# Altium project WaterPurifier.PrjPcb
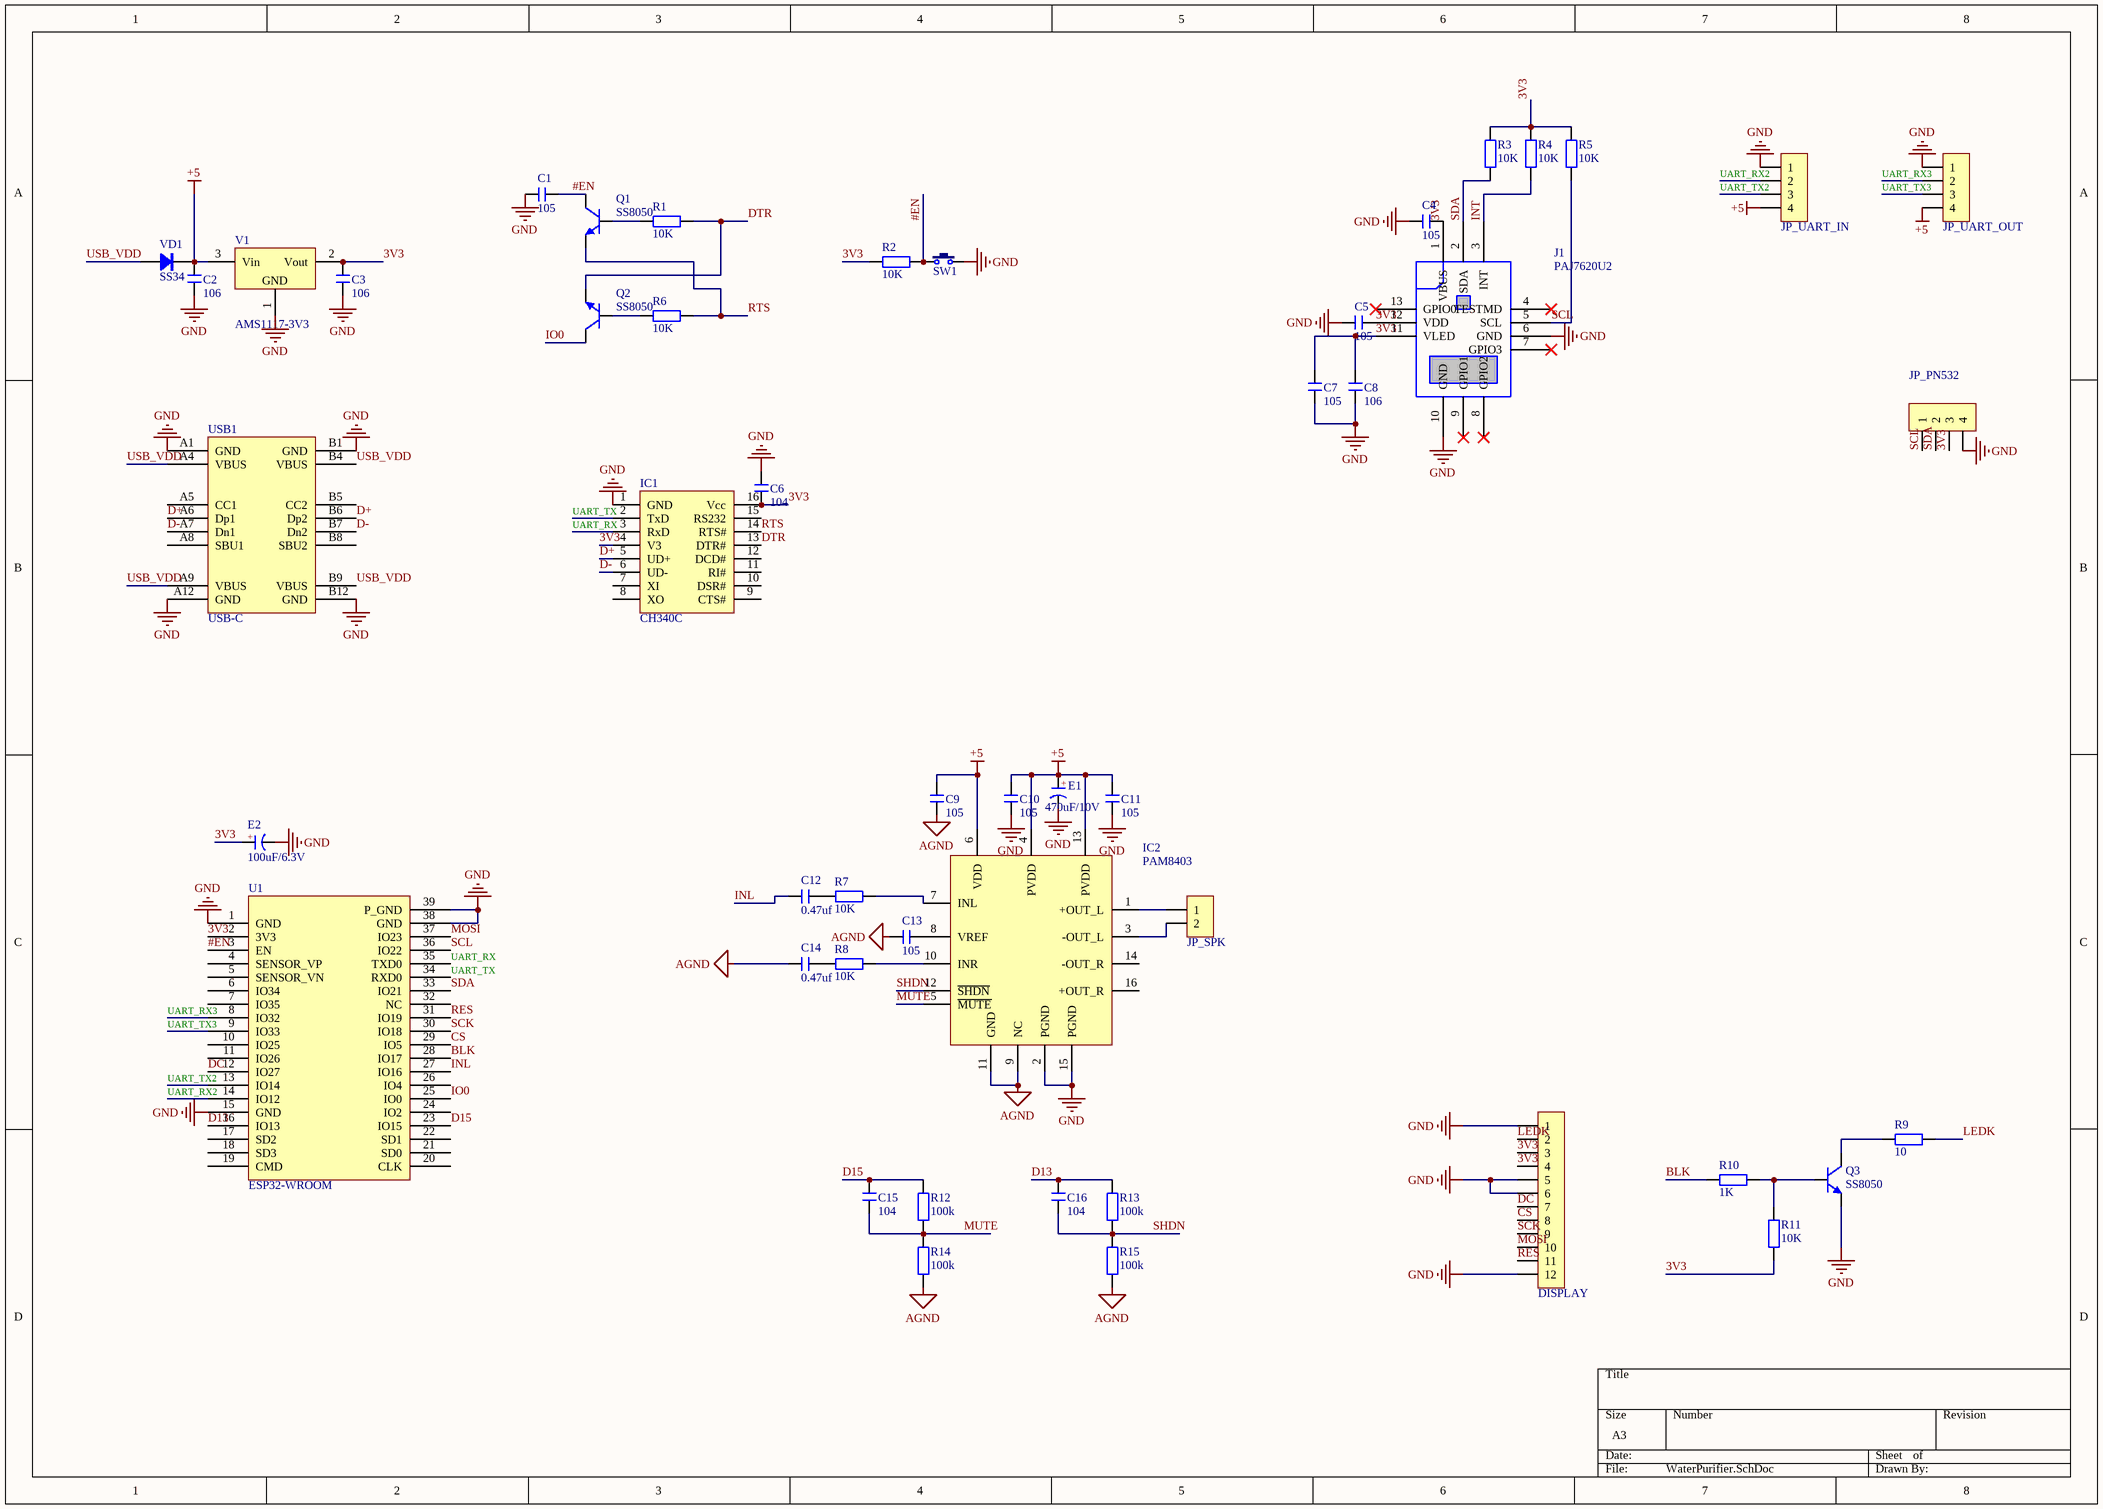
[diagram p0: WaterPurifier.SchDoc]
1 sheet, 49 parts. Net scope: global (net labels, ports and power ports of the same name join across sheets).
Board file: WaterPurifier.PcbDoc

## Sheet WaterPurifier.SchDoc
size A3

### Parts
C1  105  [C 0603_L]
C2  106  [C 0603_L]
C3  106  [C 0603_L]
C4  105  [C 0603_L]
C5  105  [C 0603_L]
C6  104  [C 0603_L]
C7  105  [C 0603_L]
C8  106  [C 0603_L]
C9  105  [C 0603_L]
C10  105  [C 0603_L]
C11  105  [C 0603_L]
C12  0.47uf  [C 0603_L]
C13  105  [C 0603_L]
C14  0.47uf  [C 0603_L]
C15  104  [C 0603_L]
C16  104  [C 0603_L]
DISPLAY  FPC1.0-12P  [FPC0.7 2H-WS-12P]  (value not drawn)
E1  470uF/10V  [CM D(6.3*7.7)]
E2  100uF/6.3V  [CD A(3216)]
IC1  CH340C  [SOP16_N]
IC2  PAM8403  [SOP16_N]
J1  PAJ7620U2  [PAJ7620U2]
JP_PN532  HDR-1X4  [XH2.54-LI-4P]  (value not drawn)
JP_SPK  HDR-1X2  [XH2.54-LI-2P]  (value not drawn)
JP_UART_IN  HDR-1X4  [XH2.54-LI-4P]  (value not drawn)
JP_UART_OUT  HDR-1X4  [XH2.54-LI-4P]  (value not drawn)
Q1  SS8050  [SOT23-3N]
Q2  SS8050  [SOT23-3N]
Q3  SS8050  [SOT23-3N]
R1  10K  [R 0603_L]
R2  10K  [R 0603_L]
R3  10K  [R 0603_L]
R4  10K  [R 0603_L]
R5  10K  [R 0603_L]
R6  10K  [R 0603_L]
R7  10K  [R 0603_L]
R8  10K  [R 0603_L]
R9  10  [R 0603_L]
R10  1K  [R 0603_L]
R11  10K  [R 0603_L]
R12  100k  [R 0603_L]
R13  100k  [R 0603_L]
R14  100k  [R 0603_L]
R15  100k  [R 0603_L]
SW1  3x6x5  [TS3x4x2]  (value not drawn)
U1  ESP32-WROOM  [ESP32-WROOM]
USB1  USB-C  [USB Type-C-16Pin_A]
V1  AMS1117-3V3  [SOT223_N]
VD1  SS34  [SMA]

### Nets
+5: C2.2 C9.2 C10.2 C11.2 E1.1(A) IC2.4(PVDD) IC2.6(VDD) IC2.13(PVDD) JP_UART_IN.4 JP_UART_OUT.4 V1.3(Vin) VD1.2(K)
AGND: C9.1 C13.2 C14.2 IC2.9(NC) IC2.11(GND) R14.1 R15.1
GND: C1.1 C2.1 C3.1 C4.1 C5.1 C6.1 C7.1 C8.1 C10.1 C11.1 DISPLAY.1 DISPLAY.5 DISPLAY.6 DISPLAY.12 E1.2(K) E2.2(K) IC1.1(GND) IC2.2(PGND) IC2.15(PGND) J1.6(GND) J1.10(GND) JP_PN532.4 JP_UART_IN.1 JP_UART_OUT.1 Q3.2(E) SW1.2 U1.1(GND) U1.15(GND) U1.38(GND) U1.39(P_GND) USB1.A1(GND) USB1.A12(GND) USB1.B1(GND) USB1.B12(GND) V1.1(GND)
3V3: C3.2 C4.2 C5.2 C6.2 C7.2 C8.2 DISPLAY.3 DISPLAY.4 E2.1(A) IC1.4(V3) IC1.16(Vcc) J1.1(VBUS) J1.11(VLED) J1.12(VDD) JP_PN532.3 R2.2 R3.1 R4.1 R5.1 R11.1 U1.2(3V3) V1.2(Vout)
#EN: C1.2 Q1.3(C) R2.1 SW1.1 U1.3(EN)
BLK: R10.1 U1.28(IO17)
CS: DISPLAY.8 U1.29(IO5)
D13: C16.2 R13.2 U1.16(IO13)
D15: C15.2 R12.2 U1.23(IO15)
D+: IC1.5(UD+) USB1.A6(Dp1) USB1.B6(Dp2)
D-: IC1.6(UD-) USB1.A7(Dn1) USB1.B7(Dn2)
DC: DISPLAY.7 U1.12(IO27)
DTR: IC1.13(DTR#) Q2.2(E) R1.1
INL: C12.2 U1.27(IO16)
INT: J1.3(INT) R4.2
IO0: Q2.3(C) U1.25(IO0)
LEDK: DISPLAY.2 R9.1
MOSI: DISPLAY.10 U1.37(IO23)
MUTE: C15.1 IC2.5(~{MUTE}) R12.1 R14.2
RES: DISPLAY.11 U1.31(IO19)
RTS: IC1.14(RTS#) Q1.2(E) R6.1
SCK: DISPLAY.9 U1.30(IO18)
SCL: J1.5(SCL) JP_PN532.1 R5.2 U1.36(IO22)
SDA: J1.2(SDA) JP_PN532.2 R3.2 U1.33(IO21)
SHDN: C16.1 IC2.12(~{SHDN}) R13.1 R15.2
UART_RX: IC1.3(RxD) U1.35(TXD0)
UART_RX2: JP_UART_IN.2 U1.14(IO12)
UART_RX3: JP_UART_OUT.2 U1.8(IO32)
UART_TX: IC1.2(TxD) U1.34(RXD0)
UART_TX2: JP_UART_IN.3 U1.13(IO14)
UART_TX3: JP_UART_OUT.3 U1.9(IO33)
USB_VDD: USB1.A4(VBUS) USB1.A9(VBUS) USB1.B4(VBUS) USB1.B9(VBUS) VD1.1(A)
NetC12_1: C12.1 R7.1
NetC13_1: C13.1 IC2.8(VREF)
NetC14_1: C14.1 R8.1
NetIC2_1: IC2.1(+OUT_L) JP_SPK.1
NetIC2_3: IC2.3(-OUT_L) JP_SPK.2
NetIC2_7: IC2.7(INL) R7.2
NetIC2_10: IC2.10(INR) R8.2
NetQ1_1: Q1.1(B) R1.2
NetQ2_1: Q2.1(B) R6.2
NetQ3_1: Q3.1(B) R10.2 R11.2
NetQ3_3: Q3.3(C) R9.2

Not connected (* = marked no-connect by the designer): IC1 7(XI) 8(XO) 9(CTS#) 10(DSR#) 11(RI#) 12(DCD#) 15(RS232); IC2 14(-OUT_R) 16(+OUT_R); J1 4(TESTMD)* 7(GPIO3)* 8(GPIO2)* 9(GPIO1)* 13(GPIO0)*; U1 4(SENSOR_VP) 5(SENSOR_VN) 6(IO34) 7(IO35) 10(IO25) 11(IO26) 17(SD2) 18(SD3) 19(CMD) 20(CLK) 21(SD0) 22(SD1) 24(IO2) 26(IO4) 32(NC); USB1 A5(CC1) A8(SBU1) B5(CC2) B8(SBU2)

### Notes on the sheet
- (in symbol C-CD) +
- (in symbol C-CM) +

### Library data of the parts
C1-C16 = C: 无极性贴片电容; 版权归属: 源创客; 材质: X7R; BOM名称: 无极性贴片电容; 学习资源: www.ooocke.com
DISPLAY = FPC-12P: FPC连接器; 版权归属: 源创客; BOM名称: FPC连接器; 学习资源: www.ooocke.com
E1 = C-CM: 贴片电解电容; 版权归属: 源创客; BOM名称: 贴片电解电容; 学习资源: www.ooocke.com
E2 = C-CD: 贴片钽电容; 版权归属: 源创客; BOM名称: 贴片钽电容; 学习资源: www.ooocke.com
IC1 = CH340G: 串口转USB; 版权归属: 源创客; BOM名称: 串口转USB; 学习资源: www.ooocke.com
IC2 = PAM8403: 2X3W D类功放; 版权归属: 源创客; BOM名称: 2X3W D类功放; 学习资源: www.ooocke.com
J1 = PAJ7620U2: 反射型光耦; 版权归属: 源创客; BOM名称: 反射型光耦; 学习资源: www.ooocke.com
JP_PN532 JP_UART_IN JP_UART_OUT = Header 4: 4P接插件; 版权归属: 源创客; BOM名称: 4P接插件; 学习资源: www.ooocke.com
JP_SPK = Header 2: 2P接插件; 版权归属: 源创客; BOM名称: 2P接插件; 学习资源: www.ooocke.com
Q1-Q3 = 8050-SMD: 高频放大-NPN型; 版权归属: 源创客; 属性: 40V 1.5A 1W 100MHZ; BOM名称: 高频放大-NPN型; 学习资源: www.ooocke.com
R1-R15 = R: 贴片电阻; 版权归属: 源创客; BOM名称: 贴片电阻; 学习资源: www.ooocke.com
SW1 = TS 3x4: 3x6轻触开关; 版权归属: 源创客; BOM名称: 3x6轻触开关; 学习资源: www.ooocke.com
USB1 = USB-C-16P: USB-C型母接口; 版权归属: 源创客; BOM名称: USB-C型母接口; 学习资源: www.ooocke.com
V1 = AMS1117: 三端稳压芯片; BOM名称: 稳压芯片; 版权归属: 源创客; 学习资源: www.ooocke.com
VD1 = SS14: 肖特基二极管; 版权归属: 源创客; 属性: 40V/1A; BOM名称: 肖特基二极管; 学习资源: www.ooocke.com